# Altium schematic sheet initial circuit.SchDoc
size 279 x 299 mm; SheetNumber: 1; SheetTotal: 1
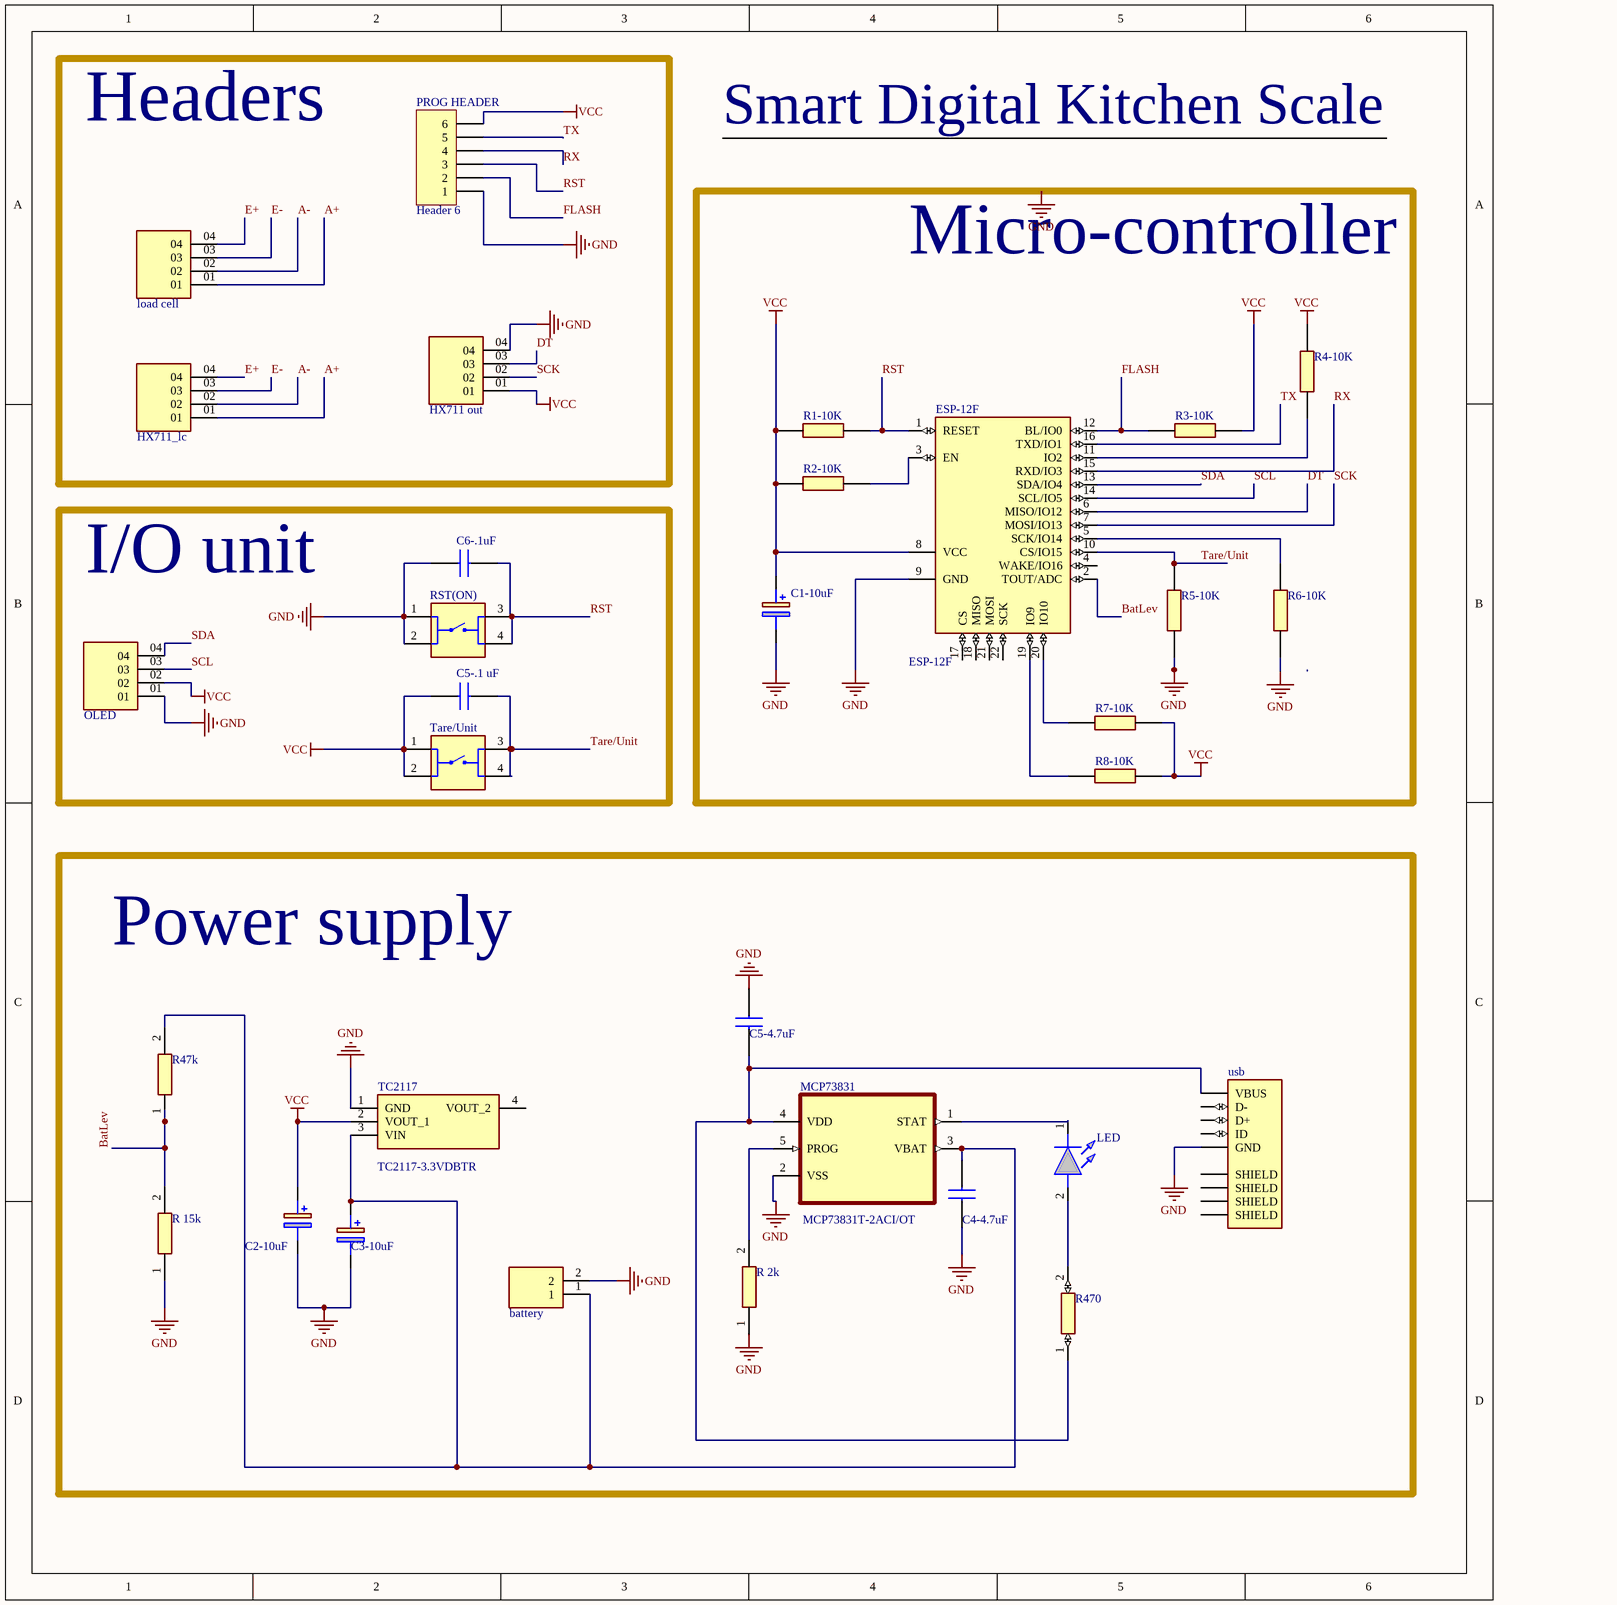
[diagram p0: initial circuit.SchDoc]

## Parts
battery  B2B-XH-A(LF)(SN)  [JST_B2B-XH-A(LF)(SN)]  (value not drawn)
C1-10uF  865080340001  [CAPAE430X550N]  (value not drawn)
C2-10uF  865080340001  [CAPAE430X550N]  (value not drawn)
C3-10uF  865080340001  [CAPAE430X550N]  (value not drawn)
C4-4.7uF  885012107013  [CAPC2012X145N]  (value not drawn)
C5-4.7uF  885012107013  [CAPC2012X145N]  (value not drawn)
C5-.1_uF  C0805C104K5RAC7411  [CAPC2012X88N]  (value not drawn)
C6-.1uF  C0805C104K5RAC7411  [CAPC2012X88N]  (value not drawn)
ESP-12F  ESP-12F  [ESP-12F]
HX711_lc  MTSW-104-XX-X-S-XXX  [SAMTEC_MTSW-104-XX-X-S-XXX]  (value not drawn)
HX711_out  MTSW-104-XX-X-S-XXX  [SAMTEC_MTSW-104-XX-X-S-XXX]  (value not drawn)
LED  CLM3C-AKW-CUAVB253  [LEDM3020X140N]  (value not drawn)
load_cell  MTSW-104-XX-X-S-XXX  [SAMTEC_MTSW-104-XX-X-S-XXX]  (value not drawn)
MCP73831  MCP73831T-2ACI/OT  [SOT95P280X145-5N]
OLED  MTSW-104-XX-X-S-XXX  [SAMTEC_MTSW-104-XX-X-S-XXX]  (value not drawn)
PROG_HEADER  Header 6  [HDR1X6]
R1-10K  CRGCQ0805J10K  [RESC2013X65N]  (value not drawn)
R2-10K  CRGCQ0805J10K  [RESC2013X65N]  (value not drawn)
R3-10K  CRGCQ0805J10K  [RESC2013X65N]  (value not drawn)
R4-10K  CRGCQ0805J10K  [RESC2013X65N]  (value not drawn)
R5-10K  CRGCQ0805J10K  [RESC2013X65N]  (value not drawn)
R6-10K  CRGCQ0805J10K  [RESC2013X65N]  (value not drawn)
R7-10K  CRGCQ0805J10K  [RESC2013X65N]  (value not drawn)
R8-10K  CRGCQ0805J10K  [RESC2013X65N]  (value not drawn)
R47k  CR0805-JW-473ELF  [RESC2012X60N]  (value not drawn)
R470  CRCW0805470RFKEAC  [RESC2012X60N]  (value not drawn)
R_2k  CR0805-JW-202ELF  [RESC2012X60N]  (value not drawn)
R_15k  ERJ-6GEYJ153V  [RESC2012X70N]  (value not drawn)
RST(ON)  1825910-2  [TE_1825910-2]  (value not drawn)
Tare/Unit  1825910-2  [TE_1825910-2]  (value not drawn)
TC2117  TC2117-3.3VDBTR  [SOT230P700X180-4N]
usb  USB3090-XX-X_REVE  [GCT_USB3090-XX-X_REVE]  (value not drawn)

## Blocks framed on the sheet
Headers: HX711_lc HX711_out load_cell PROG_HEADER
Micro-controller: C1-10uF ESP-12F R1-10K R2-10K R3-10K R4-10K R5-10K R6-10K R7-10K R8-10K
I/O unit: C5-.1_uF C6-.1uF OLED RST(ON) Tare/Unit
Power supply: battery C2-10uF C3-10uF C4-4.7uF C5-4.7uF LED MCP73831 R47k R470 R_2k R_15k TC2117 usb

## Nets
GND: battery.2 C1-10uF.2(-) C2-10uF.2(-) C3-10uF.2(-) C4-4.7uF.1 C5-4.7uF.2 C6-.1uF.1 ESP-12F.9(GND) HX711_out.04 MCP73831.2(VSS) OLED.01 PROG_HEADER.1 R5-10K.2 R6-10K.2 R_2k.1 R_15k.1 RST(ON).1 RST(ON).2 TC2117.1(GND) usb.5(GND)
VCC: C1-10uF.1(+) C2-10uF.1(+) C5-.1_uF.1 ESP-12F.8(VCC) HX711_out.01 OLED.02 PROG_HEADER.6 R1-10K.1 R2-10K.1 R3-10K.2 R4-10K.1 R7-10K.2 R8-10K.2 Tare/Unit.1 Tare/Unit.2 TC2117.2(VOUT_1)
A+: HX711_lc.01 load_cell.01
A-: HX711_lc.02 load_cell.02
BatLev: ESP-12F.2(TOUT/ADC) R47k.1 R_15k.2
DT: ESP-12F.6(MISO/IO12) HX711_out.03
E+: HX711_lc.04 load_cell.04
E-: HX711_lc.03 load_cell.03
FLASH: ESP-12F.12(BL/IO0) PROG_HEADER.2 R3-10K.1
RST: C6-.1uF.2 ESP-12F.1(RESET) PROG_HEADER.3 R1-10K.2 RST(ON).3 RST(ON).4
RX: ESP-12F.15(RXD/IO3) PROG_HEADER.4
SCK: ESP-12F.7(MOSI/IO13) HX711_out.02
SCL: ESP-12F.14(SCL/IO5) OLED.03
SDA: ESP-12F.13(SDA/IO4) OLED.04
Tare/Unit: C5-.1_uF.2 ESP-12F.10(CS/IO15) R5-10K.1 Tare/Unit.3 Tare/Unit.4
TX: ESP-12F.16(TXD/IO1) PROG_HEADER.5
Netbattery_1: battery.1 C3-10uF.1(+) C4-4.7uF.2 MCP73831.3(VBAT) R47k.2 TC2117.3(VIN)
NetC5-4.7uF_1: C5-4.7uF.1 MCP73831.4(VDD) R470.1 usb.1(VBUS)
NetESP-12F_3: ESP-12F.3(EN) R2-10K.2
NetESP-12F_5: ESP-12F.5(SCK/IO14) R6-10K.1
NetESP-12F_11: ESP-12F.11(IO2) R4-10K.2
NetESP-12F_19: ESP-12F.19(IO9) R8-10K.1
NetESP-12F_20: ESP-12F.20(IO10) R7-10K.1
NetLED_1: LED.1(K) MCP73831.1(STAT)
NetLED_2: LED.2(A) R470.2
NetMCP73831_5: MCP73831.5(PROG) R_2k.2

Not connected (* = marked no-connect by the designer): ESP-12F 4(WAKE/IO16) 17(CS) 18(MISO) 21(MOSI) 22(SCK); TC2117 4(VOUT_2); usb 2(D-) 3(D+) 4(ID) 6(SHIELD) 7(SHIELD) 8(SHIELD) 9(SHIELD)

## Notes on the sheet
- Smart Digital Kitchen Scale
- Labels drawn without touching a wire or pin: GND

## Library data of the parts
battery = B2B-XH-A(LF)(SN): Connector Header Through Hole 2 position 0.098 (2.50mm); MF: JST Sales; Value: *; MP: B2B-XH-A(LF)(SN); Purchase-URL: https://pricing.snapeda.com/search/part/B2B-XH-A(LF)(SN)/?ref=eda; Availability: In Stock; Price: None; Package: None
C1-10uF C2-10uF C3-10uF = 865080340001: Wurth Elektronik 10uF 16 V dc Aluminium Electrolytic Capacitor, WCAP-ASLI Series 2000h 4 (Dia.) x 5.35mm; Geometry.Height: 5.5mm; Manufacturer_Name: Wurth Elektronik; Manufacturer_Part_Number: 865080340001; Mouser Part Number: 710-865080340001; Mouser Price/Stock: https://www.mouser.co.uk/ProductDetail/Wurth-Elektronik/865080340001?qs=0KOYDY2FL2%252BaqRFD837lAw%3D%3D; Arrow Part Number: *; Arrow Price/Stock: *; Datasheet Link: https://componentsearchengine.com/Datasheets/1/865080340001.pdf
C4-4.7uF C5-4.7uF = 885012107013: Multilayer Ceramic Capacitor 4.7uF 0805; Manufacturer_Name: Wurth Elektronik; Geometry.Height: 1.45mm; Manufacturer_Part_Number: 885012107013; Mouser Part Number: 710-885012107013; Mouser Price/Stock: https://www.mouser.co.uk/ProductDetail/Wurth-Elektronik/885012107013?qs=0KOYDY2FL29a055VqgRqNw%3D%3D; Arrow Part Number: *; Arrow Price/Stock: *; Datasheet Link: https://katalog.we-online.de/pbs/datasheet/885012107013.pdf
C5-.1_uF C6-.1uF = C0805C104K5RAC7411: Cap Ceramic 0.1uF 50V X7R 10% Pad SMD 0805 125C T/R; Manufacturer_Name: KEMET; Geometry.Height: 0.88mm; Manufacturer_Part_Number: C0805C104K5RAC7411; Mouser Part Number: 80-C0805C104K5RACLR; Mouser Price/Stock: https://www.mouser.co.uk/ProductDetail/KEMET/C0805C104K5RAC7411?qs=jbRM9o5BbzPcVXF0wW9AYg%3D%3D; Arrow Part Number: C0805C104K5RAC7411; Arrow Price/Stock: https://www.arrow.com/en/products/c0805c104k5rac7411/kemet-corporation; Datasheet Link: https://www.mouser.com/datasheet/2/212/KEM_C1002_X7R_SMD-1102033.pdf
ESP-12F = ESP-12F: WiFi Module; MF: AI-Thinker; Value: *; SnapEDA_Link: https://www.snapeda.com/parts/ESP-12F/AI-Thinker/view-part/?ref=snap; Availability: Not in stock; Price: None; Package: Package; Check_prices: https://www.snapeda.com/parts/ESP-12F/AI-Thinker/view-part/?ref=eda; MP: ESP-12F
HX711_lc HX711_out load_cell OLED = MTSW-104-XX-X-S-XXX: MF: Samtec; MP: MTSW-104-12-F-S-850; SnapEDA_Link: https://www.snapeda.com/parts/MTSW-104-12-F-S-850/Samtec/view-part/6593359/?ref=snap; Value: *; Check_prices: https://www.snapeda.com/parts/MTSW-104-12-F-S-850/Samtec/view-part/6593359/?ref=eda; Price: None; Availability: No availability data; Package: None
LED = CLM3C-AKW-CUAVB253: Standard LEDs - SMD Amber LED Cree PLCC2 1 in 1 SMD LED CLM3C-RKW/AKW; Manufacturer_Name: Wolfspeed; Geometry.Height: 1.4mm; Manufacturer_Part_Number: CLM3C-AKW-CUAVB253; Mouser Part Number: 941-CLM3CAKWCUAVB253; Mouser Price/Stock: https://www.mouser.co.uk/ProductDetail/Cree-LED/CLM3C-AKW-CUAVB253?qs=3AcK5DacLbqERPW6%2FzkoPg%3D%3D; Arrow Part Number: *; Arrow Price/Stock: *; Datasheet Link: https://www.mouser.co.uk/datasheet/2/90/CLM3CRKWAKW1156-274590.pdf
MCP73831 = MCP73831T-5ACI/OT: Charger IC Lithium Ion/Polymer SOT-23-5; MF: Microchip; MP: MCP73831T-5ACI/OT; Package: SOT-23-5 Microchip; SnapEDA_Link: https://www.snapeda.com/parts/MCP73831T-5ACI/OT/Microchip/view-part/1037579/?ref=snap; Availability: Unavailable; Price: None; Value: *
PROG_HEADER = Header 6: Header, 6-Pin; LatestRevisionDate: 17-Jul-2002; LatestRevisionNote: Re-released for DXP Platform.; Publisher: Altium Limited
R1-10K R2-10K R3-10K R4-10K R5-10K R6-10K R7-10K R8-10K = CRGCQ0805J10K: TE CONNECTIVITY - CRGCQ0805J10K - RES, 10K, 5%, 0805, THICK FILM; Geometry.Height: 0.65mm; Mouser Part Number: 279-CRGCQ0805J10K; Mouser Price/Stock: https://www.mouser.co.uk/ProductDetail/TE-Connectivity-Holsworthy/CRGCQ0805J10K?qs=wUXugUrL1qw7JO9BgWPrfA%3D%3D; Manufacturer_Name: TE Connectivity; Manufacturer_Part_Number: CRGCQ0805J10K; Datasheet Link: https://www.te.com/commerce/DocumentDelivery/DDEController?Action=showdoc&DocId=Data+Sheet%7F1773204-3%7F1%7Fpdf%7FEnglish%7FENG_DS_1773204-3_1.pdf%7F2176341-1
R47k = CR0805-JW-473ELF: Resistor; Manufacturer_Name: Bourns; Datasheet Link: https://www.bourns.com/pdfs/chpreztr.pdf; Height: 0.6mm; Manufacturer_Part_Number: CR0805-JW-473ELF; Mouser Part Number: 652-CR0805JW-473ELF; Mouser Price/Stock: https://www.mouser.co.uk/ProductDetail/Bourns/CR0805-JW-473ELF?qs=%252BcBkmVQIZ2S5L%2FTv0l5Nkg%3D%3D; Arrow Part Number: CR0805-JW-473ELF; Arrow Price/Stock: https://www.arrow.com/en/products/cr0805-jw-473elf/bourns?region=nac
R470 = CRCW0805470RFKEAC: Resistor; Manufacturer_Name: Vishay; Datasheet Link: https://mouser.componentsearchengine.com/Datasheets/1/CRCW0805470RFKEAC.pdf; Height: 0.6mm; Manufacturer_Part_Number: CRCW0805470RFKEAC; Mouser Part Number: 71-CRCW0805470RFKEAC; Mouser Price/Stock: https://www.mouser.co.uk/ProductDetail/Vishay-Dale/CRCW0805470RFKEAC?qs=E3Y5ESvWgWPsF5leBpDSrQ%3D%3D; Arrow Part Number: CRCW0805470RFKEAC; Arrow Price/Stock: https://www.arrow.com/en/products/crcw0805470rfkeac/vishay?region=nac
R_2k = CR0805-JW-202ELF: Resistor; Manufacturer_Name: Bourns; Datasheet Link: https://www.bourns.com/pdfs/chpreztr.pdf; Height: 0.6mm; Manufacturer_Part_Number: CR0805-JW-202ELF; Mouser Part Number: 652-CR0805JW-202ELF; Mouser Price/Stock: https://www.mouser.co.uk/ProductDetail/Bourns/CR0805-JW-202ELF?qs=wL7NMIHXUPnyGz%2Fa3t%2FGQg%3D%3D; Arrow Part Number: CR0805-JW-202ELF; Arrow Price/Stock: https://www.arrow.com/en/products/cr0805-jw-202elf/bourns
R_15k = ERJ-6GEYJ153V: Resistor; Manufacturer_Name: Panasonic; Datasheet Link: https://datasheet.datasheetarchive.com/originals/distributors/DKDS40/DSANUWW0010935.pdf; Height: 0.7mm; Manufacturer_Part_Number: ERJ-6GEYJ153V; Mouser Part Number: 667-ERJ-6GEYJ153V; Mouser Price/Stock: https://www.mouser.co.uk/ProductDetail/Panasonic/ERJ-6GEYJ153V?qs=gybxhQrZOyE8NVeFJR%2FEkg%3D%3D
RST(ON) Tare/Unit = 1825910-2: 50 mA SPST Round Actuator 160 Gram Force Tactile Pushbutton Switch; MF: TE Connectivity; Check_prices: https://www.snapeda.com/parts/1825910-2/TE+Connectivity+ALCOSWITCH+Switches/view-part/?ref=eda; Value: *; Availability: In Stock; MP: 1825910-2; Price: None; Package: None; SnapEDA_Link: https://www.snapeda.com/parts/1825910-2/TE+Connectivity+ALCOSWITCH+Switches/view-part/?ref=snap; Purchase-URL: https://pricing.snapeda.com/search/part/1825910-2/?ref=eda; EU_RoHS_Compliance: Compliant
TC2117 = TC2117-3.3VDBTR: Microchip TC2117-3.3VDBTR, LDO Voltage Regulator, 800mA, 3.3 V +/-0.5%, 2.7  6 Vin, 3-Pin SOT-223; Geometry.Height: 1.8mm; Manufacturer_Name: Microchip; Manufacturer_Part_Number: TC2117-3.3VDBTR; Mouser Part Number: 579-TC2117-3.3VDBTR; Mouser Price/Stock: https://www.mouser.co.uk/ProductDetail/Microchip-Technology/TC2117-3.3VDBTR?qs=AF%252BffTaPb30YsLOBvxArLw%3D%3D; Arrow Part Number: TC2117-3.3VDBTR; Arrow Price/Stock: https://www.arrow.com/en/products/tc2117-3.3vdbtr/microchip-technology?region=nac; Datasheet Link: https://componentsearchengine.com/Datasheets/2/TC2117-3.3VDBTR.pdf
usb = USB3090-XX-X_REVE: Micro USB Receptacle, Type AB, SMT, R/A, Bottom Mount, w/out Peg, w/outer shell stakes; Package: None; Price: None; Value: *; MP: USB3090-XX-X_REVE; Availability: Unavailable